# EAGLE design APDS_9002-v10 (EAGLE 6.2)
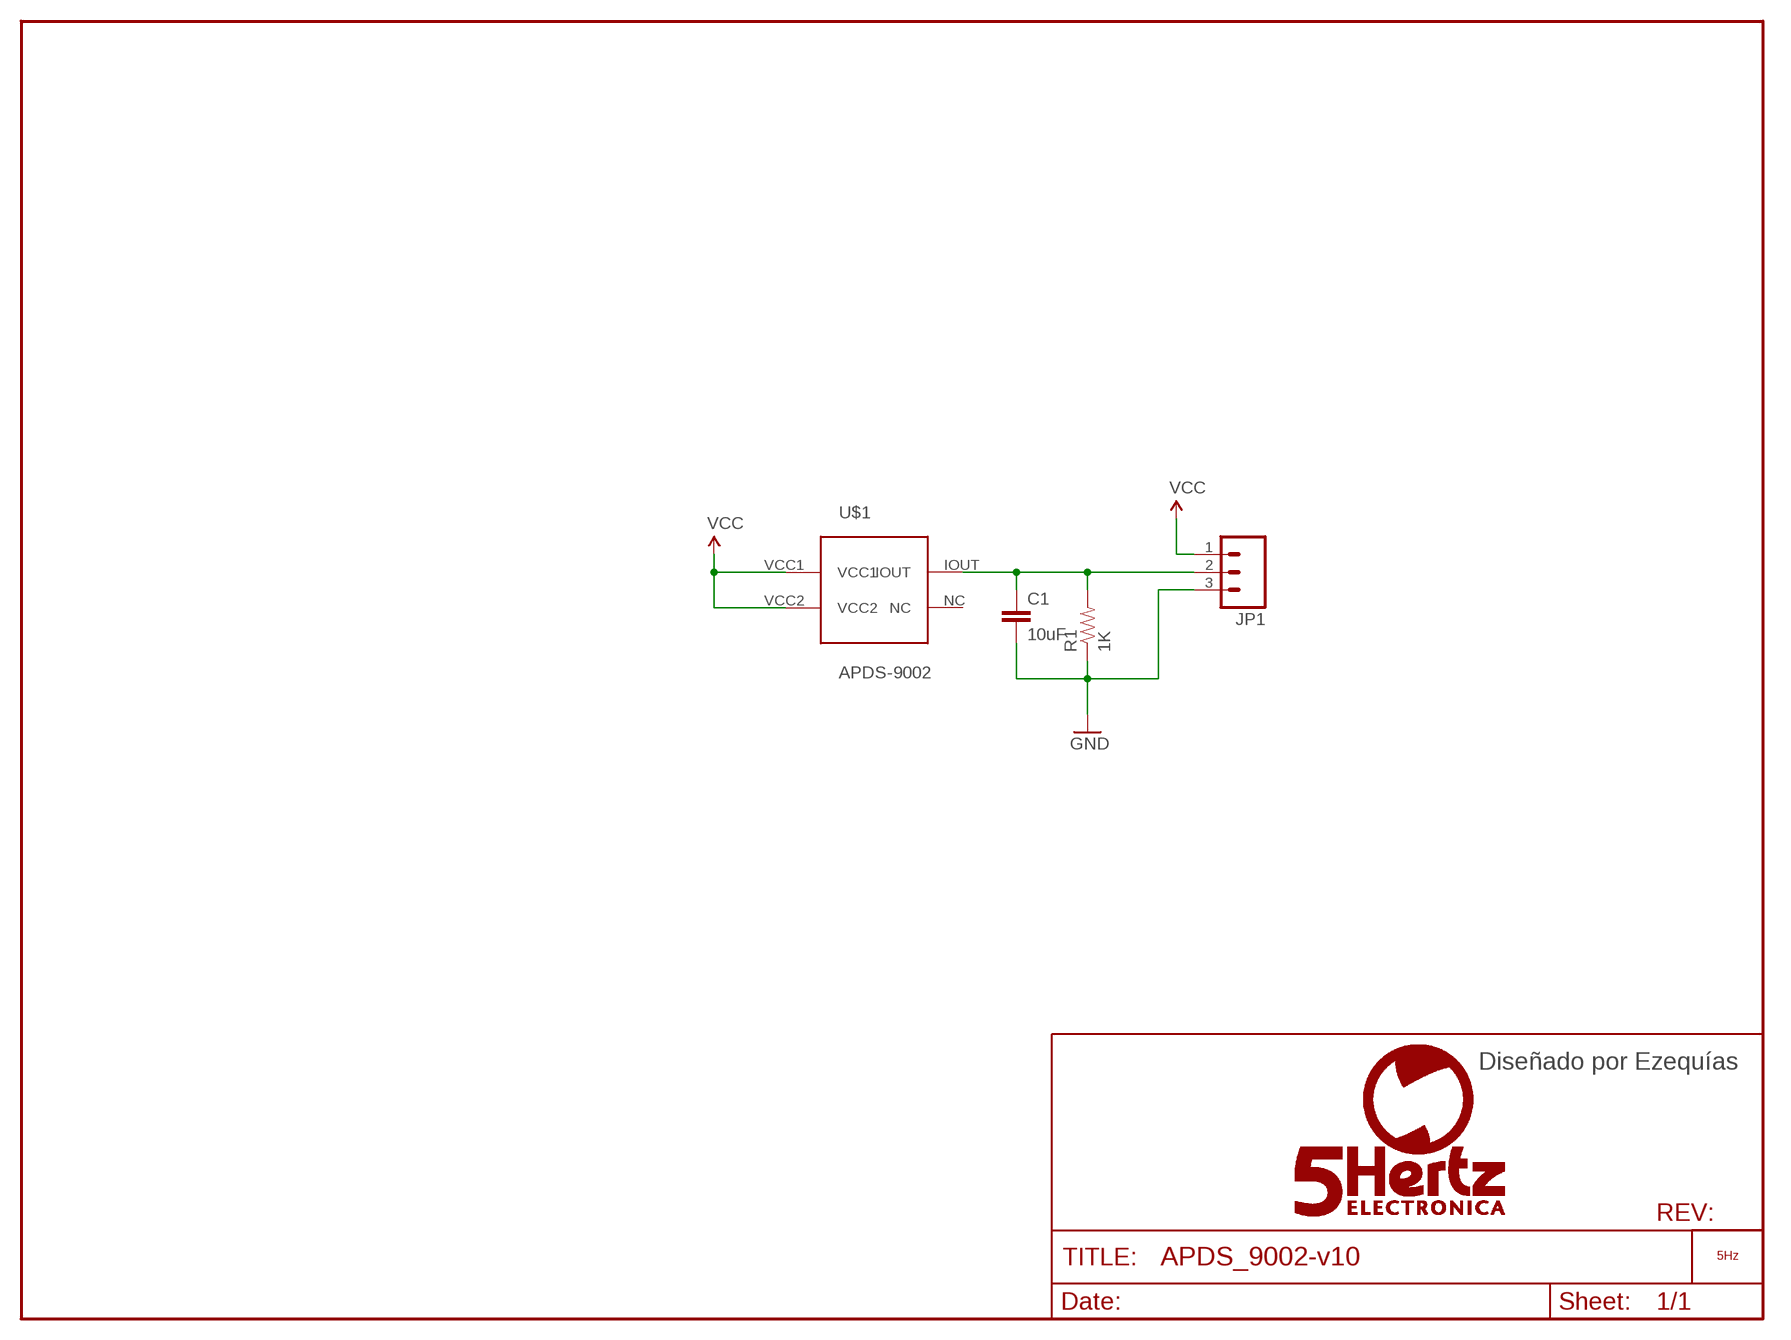
[diagram p0: schematic, sheet 1]

## Parts
C1  10uF  CAP0603-CAP  [0603-CAP]
JP1  M03PTH  [1X03]
LOGO1  LOGO_5HZ_CIRC_4MM  [5HZ_LOGO_CIRC_4MM]
R1  1K  RESISTOR0603-RES  [0603-RES]
U$1  APDS-9002  [APDS-9002]

## Nets
GND: C1.2 JP1.3 R1.1
N$1: C1.1 JP1.2 R1.2 U$1.IOUT
VCC: JP1.1 U$1.VCC1 U$1.VCC2
Unconnected: U$1.NC

## Notes on the sheet
- Diseñado por Ezequías

## Library data of the parts
C1 = 5hz-electronica:CAP: Capacitor Standard 0603 ceramic capacitor, and 0.1" leaded capacitor.
JP1 = SparkFun:M03: Header 3 Standard 3-pin 0.1" header. Use with straight break away headers (SKU : PRT-00116), right angle break away headers (PRT-00553), swiss pins (PRT-00743), machine pins (PRT-00117), and female headers (PRT-00115). Molex polarized connector foot print use with SKU : PRT-08232 with associated crimp pins and housings.
LOGO1 = 5hz-electronica:LOGO_5HZ: Logotipo 5Hz "según Pedro"
R1 = 5hz-electronica:RESISTOR: Resistor Basic schematic elements and footprints for 0603, 1206, and PTH 1/10th watt (small) resistors.
U$1 = rafael:APDS-9002: Sensor de color APDS-9002 rango de 1 lux a 1Klux

## Board
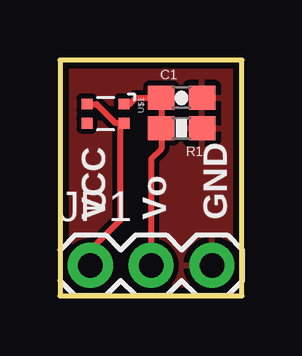
[diagram p1: board, top side]
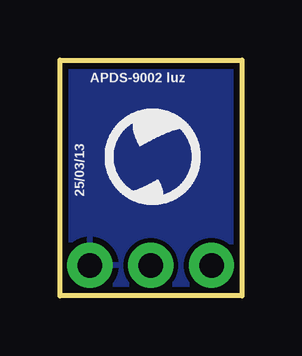
[diagram p2: board, bottom side, seen from below]

Size 7.6 x 9.83 mm. Coordinates in mm from the lower left corner, seen from the top.
Outline: 0,0 7.6,0 7.6,9.83 0,9.83 0,0
Copper layers (1*16): Top 0.035mm / dielectric 1.5mm / Bottom 0.035mm
Design rules: minimum track width 8mil, minimum drill 20mil, track to track 8mil, track to pad 8mil, pad to pad 8mil, via to via 8mil, smd to smd 8mil, copper to edge 10mil, drill to drill 8mil, minimum pad ring 12mil, minimum via ring 10mil, stop-mask expansion 4mil, vias tented up to drill 25mil, thermal gap 10mil

### Footprints (pad centres in the part's own frame; a part is rotated, then mirrored left to right if it is on the bottom)
0603-CAP = smd 1.1 x 1: 1 -0.85,0; 2 0.85,0
1X03 = drill 1.016 pad 1.88: 1 0,0; 2 2.54,0; 3 5.08,0
0603-RES = smd 1.1 x 1: 1 -0.85,0; 2 0.85,0
APDS-9002 = smd 0.45 x 0.45: IOUT -0.375,0.775; NC 0.425,-0.775; VCC1 0.425,0.775; VCC2 -0.375,-0.775

### Placement (x,y rotation side)
C1  5.08,8.26 0 top
JP1  1.27,1.27 0 top
LOGO1  5.71,3.81 0 bottom
R1  5.08,6.99 180 top
U$1  1.91,7.62 270 top

### Tracks (layer width: path | path; a pad name or v marks a point on that pad's centre or on a via)
GND
  pour Top: 0,0 0,10.16 7.62,10.16 7.62,0
  pour Bottom: 0,0 0,10.16 7.62,10.16 7.62,0
N$1
  Top 0.254: U$1.IOUT 2.92,8 3.17,8.26 C1.1 R1.2 4.23,6.13 3.81,5.71 JP1.2
VCC
  Top 0.254: JP1.1 1.27,1.91 2.54,3.17 2.54,7.05 U$1.VCC1 2.33,7.2 1.53,8 U$1.VCC2

### Text on the board
tPlace: VCC | Vo | GND
bPlace: APDS-9002 luz | 25/03/13